# EAGLE design Xbee_SHT71_Shield (EAGLE 7.2.0)
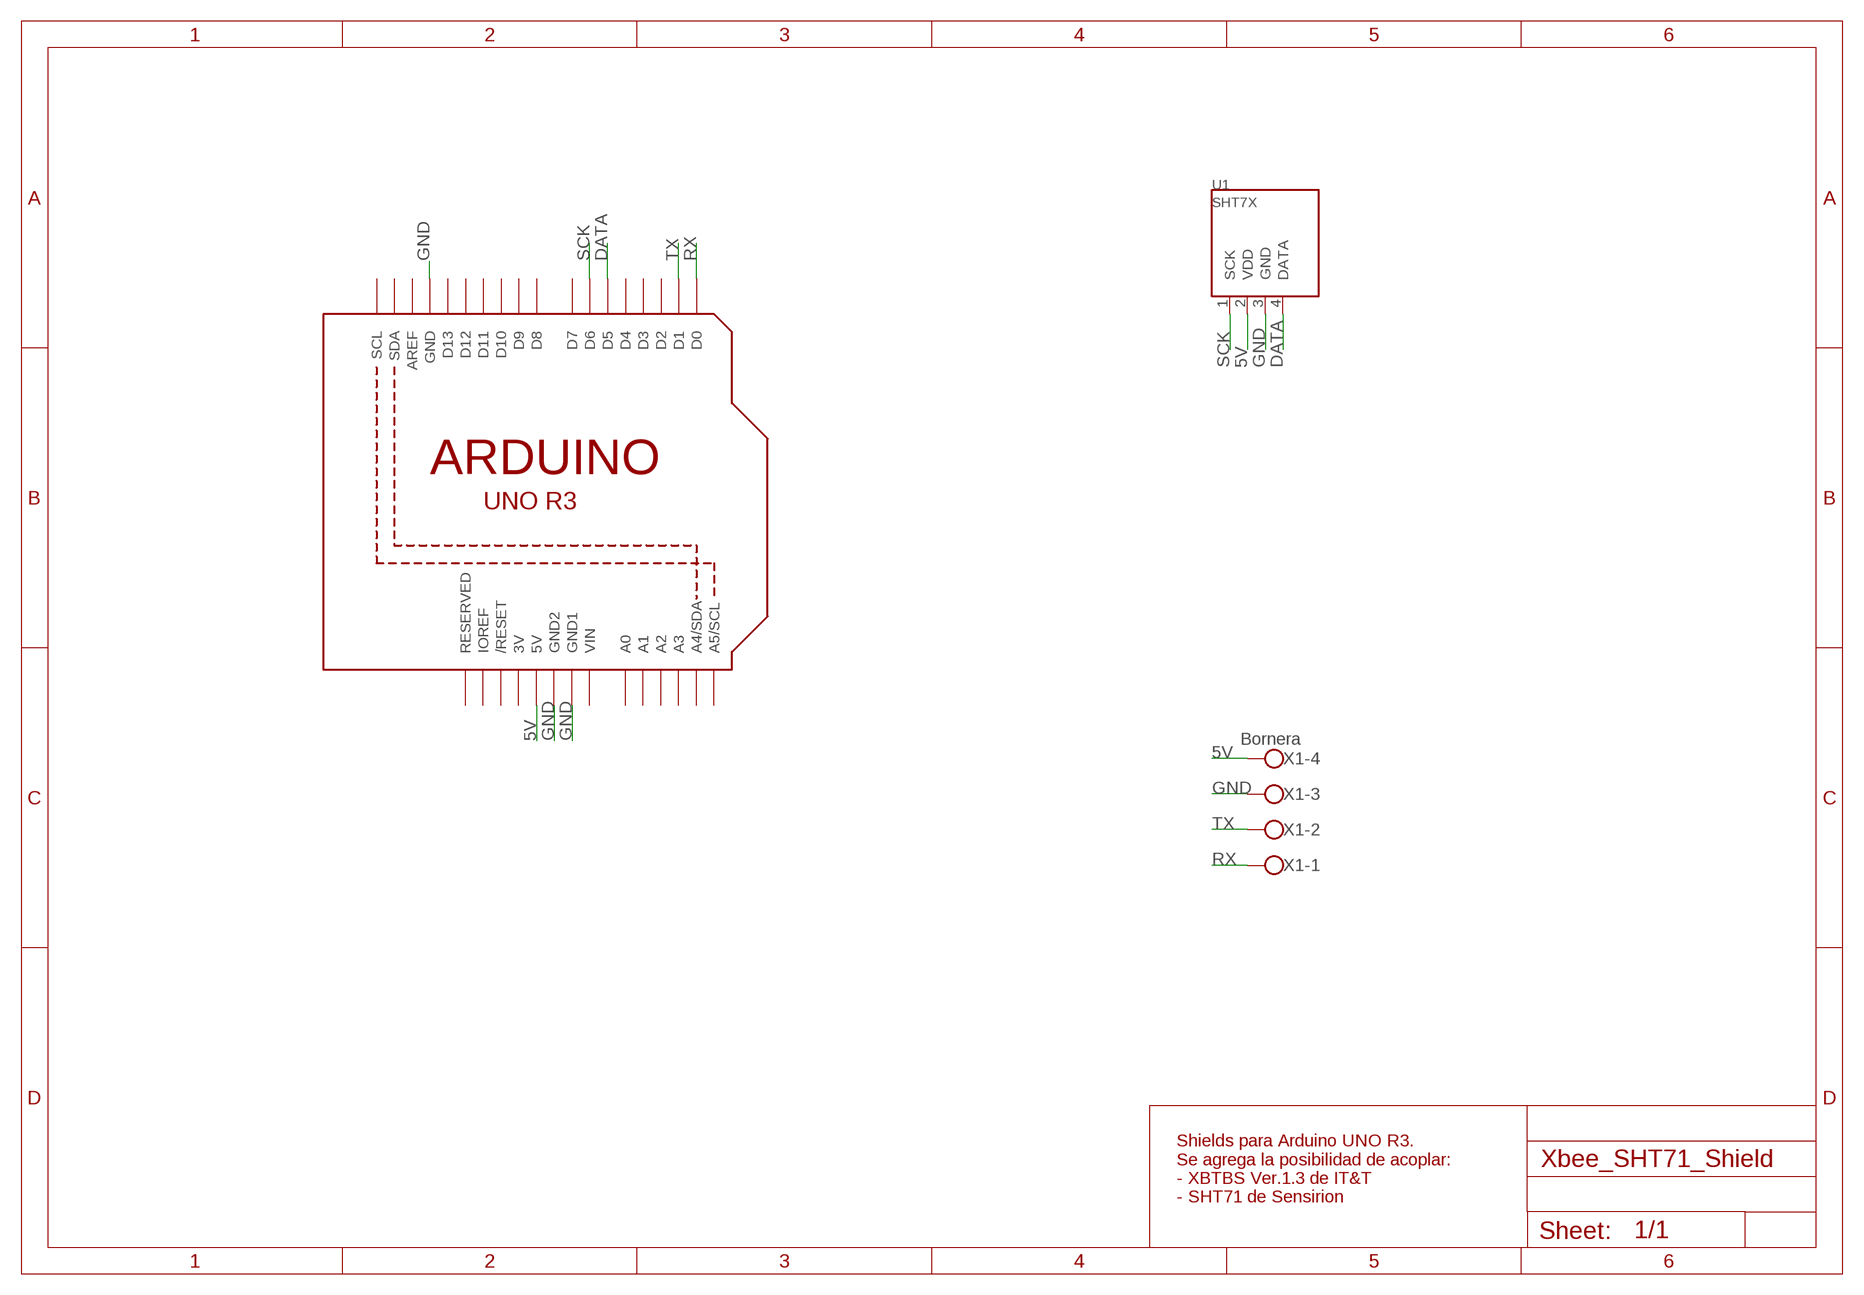
[diagram p0: schematic, sheet 1]

## Parts
U1  SHT7X  [SHT7X]
U2  ARDUINOR3-DIMENSION  [ARDUINOR3]
X1  Bornera  W237-4  [W237-4]

## Nets
5V: U1.2(VDD) U2.5V X1.4
DATA: U1.4(DATA) U2.D5
GND: U1.3(GND) U2.GND U2.GND1 U2.GND2 X1.3
RX: U2.D0 X1.1
SCK: U1.1(SCK) U2.D6
TX: U2.D1 X1.2
Unconnected: U2.A0 U2.A1 U2.A2 U2.A3 U2.A4(A4/SDA) U2.A5(A5/SCL) U2.AREF U2.D2 U2.D3 U2.D4 U2.D7 U2.D8 U2.D9 U2.D10 U2.D11 U2.D12 U2.D13 U2.IOREF U2.RESERVED U2.RESET(/RESET) U2.SCL U2.SDA

## Notes on the sheet
- Shields para Arduino UNO R3.
  Se agrega la posibilidad de acoplar:
  - XBTBS Ver.1.3 de IT&T
  - SHT71 de Sensirion

## Power pins joined to a net without a drawn wire
3V: U2.3V
VIN: U2.VIN

## Library data of the parts
U1 = SparkFun-Sensors:SHT7X: SHT71
U2 = adafruit:ARDUINOR3: This is a new object for the new Arduino R3 - with extra pins that you may want to use (such as IOref, and duplicated A4/A5
X1 = con-wago-500:W237-4: WAGO SCREW CLAMP; OC_FARNELL: unknown; OC_NEWARK: unknown

## Board
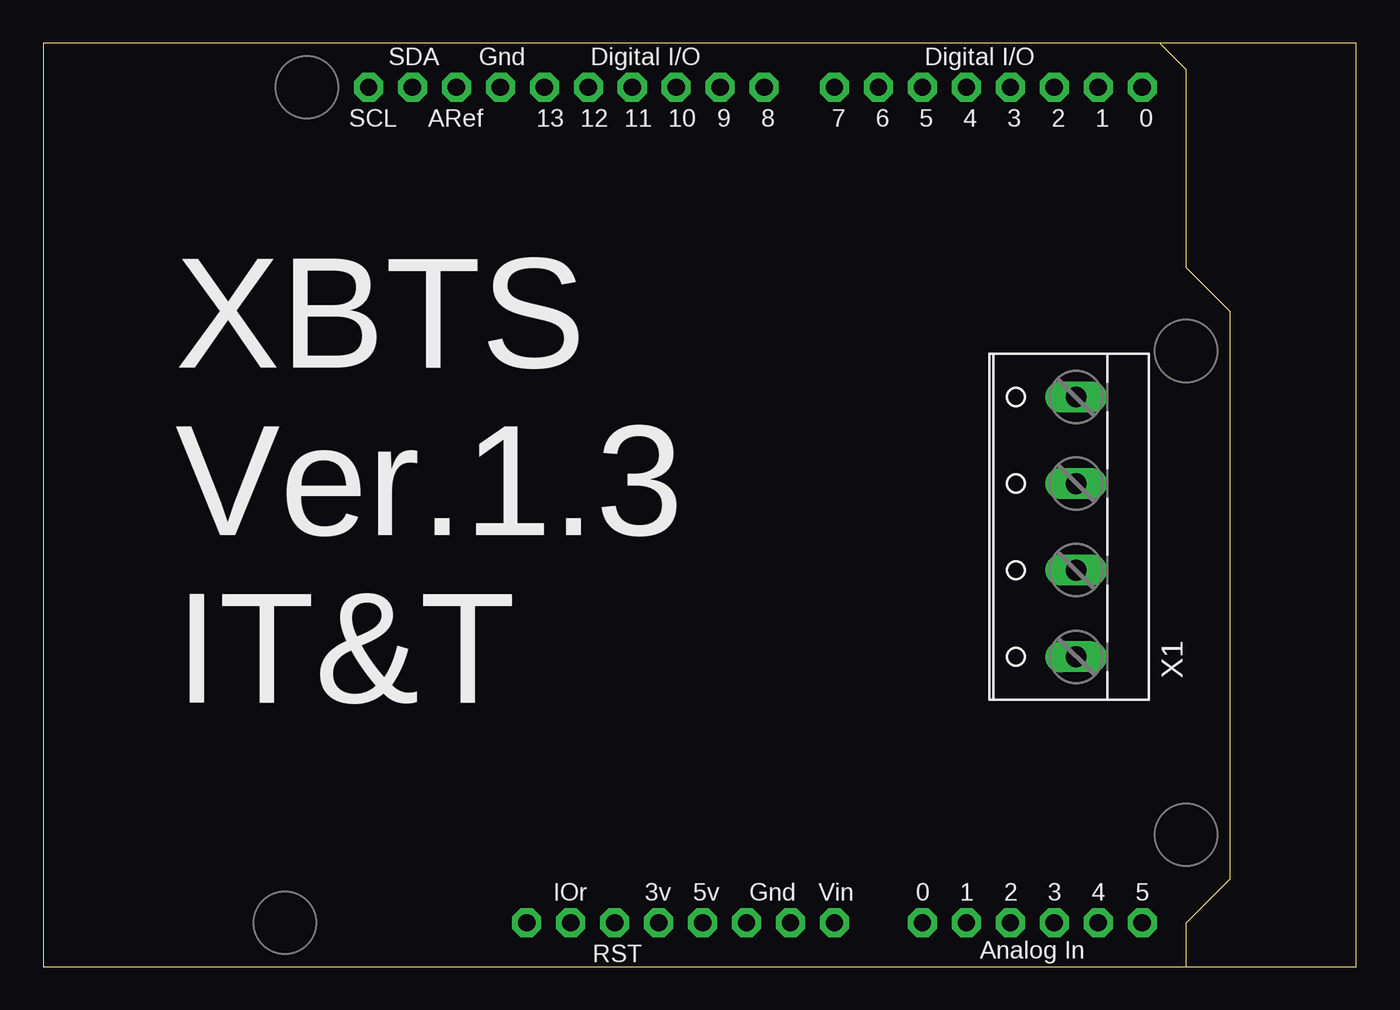
[diagram p1: board, top side]
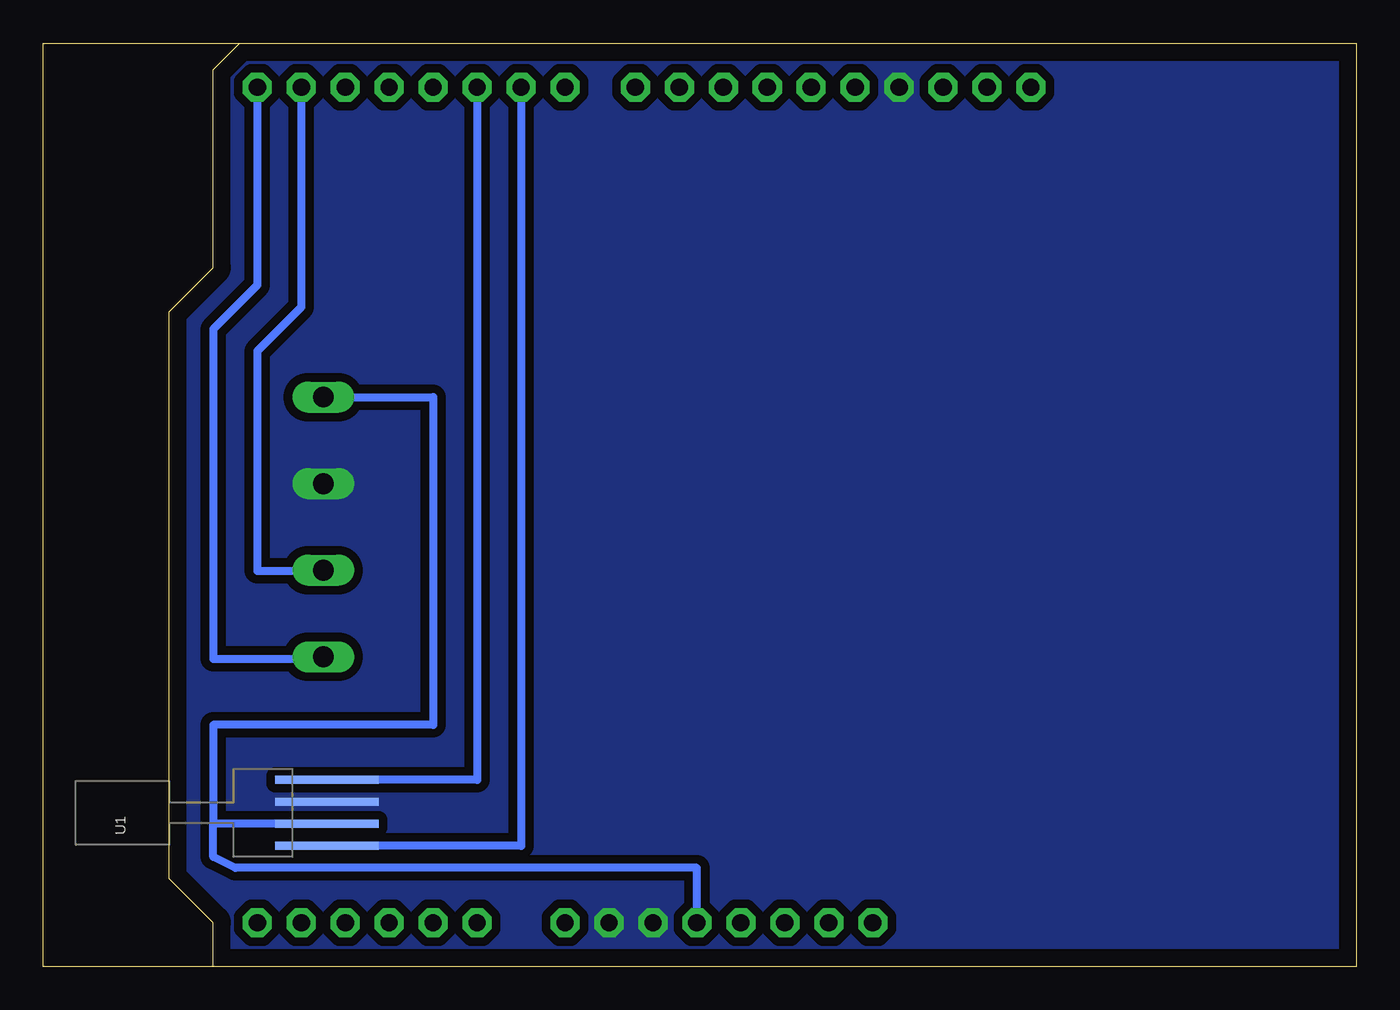
[diagram p2: board, bottom side, seen from below]

Size 75.87 x 53.34 mm. Coordinates in mm from the lower left corner, seen from the top.
Outline: 0,0 75.87,0 75.87,53.33 0,53.33 0,0
Copper layers (1*16): Top 0.035mm / dielectric 1.5mm / Bottom 0.035mm
Design rules "default *": minimum track width 10mil, minimum drill 24mil, track to track 20mil, track to pad 20mil, pad to pad 8mil, via to via 8mil, smd to smd 8mil, copper to edge 40mil, drill to drill 8mil, minimum pad ring 10mil, minimum via ring 8mil, stop-mask expansion 4mil, vias tented up to drill 0mil, thermal gap 10mil

### Footprints (pad centres in the part's own frame; a part is rotated, then mirrored left to right if it is on the bottom)
SHT7X = smd 0.46 x 6: 1 -1.905,-9.1; 2 -0.635,-9.1; 3 0.635,-9.1; 4 1.905,-9.1
ARDUINOR3 = drill 1 pad 1.676 octagon: 3V 35.56,2.54; 5V 38.1,2.54; A0 50.8,2.54; A1 53.34,2.54; A2 55.88,2.54; A3 58.42,2.54; A4 60.96,2.54; A5 63.5,2.54; AREF 23.876,50.8; D0 63.5,50.8; D1 60.96,50.8; D2 58.42,50.8; D3 55.88,50.8; D4 53.34,50.8; D5 50.8,50.8; D6 48.26,50.8; D7 45.72,50.8; D8 41.656,50.8; D9 39.116,50.8; D10 36.576,50.8; D11 34.036,50.8; D12 31.496,50.8; D13 28.956,50.8; GND 26.416,50.8; GND1 43.18,2.54; GND2 40.64,2.54; IOREF 30.48,2.54; RESERVED 27.94,2.54; RESET 33.02,2.54; SCL 18.796,50.8; SDA 21.336,50.8; VIN 45.72,2.54
W237-4 = drill 1.194 long: 1 -7.5,-1.27; 2 -2.5,-1.27; 3 2.5,-1.27; 4 7.5,-1.27

### Placement (x,y rotation side)
U1  68.58,8.89 90 bottom
U2  0,0 0 top
X1  58.42,25.4 90 top

### Tracks (layer width: path | path; a pad name or v marks a point on that pad's centre or on a via)
5V
  Bottom 0.46: U2.5V 38.1,5.71 64.77,5.71 66.04,6.35 66.04,8.26 | U1.2 66.04,8.26 | X1.4 53.34,32.9 53.34,13.97 66.04,13.97 66.04,8.26
DATA
  Bottom 0.46: U2.D5 50.8,10.79 U1.4
GND
  pour Bottom (no thermals): 0,53.34 64.77,53.34 66.04,52.07 66.04,40.64 68.58,38.1 68.58,5.08 66.04,2.54 66.04,0 0,0
RX
  Bottom 0.46: U2.D0 63.5,39.37 66.04,36.83 66.04,17.78 59.81,17.78
  Bottom 0.61: 59.81,17.78 X1.1
SCK
  Bottom 0.46: U2.D6 48.26,6.99 U1.1
TX
  Bottom 0.46: U2.D1 60.96,38.1 63.5,35.56 63.5,22.86 59.73,22.86
  Bottom 0.61: 59.73,22.86 X1.2

### Text on the board
tPlace: XBTS / Ver.1.3 / IT&T